# Altium schematic sheet Sheet1.SchDoc
size 381 x 241 mm
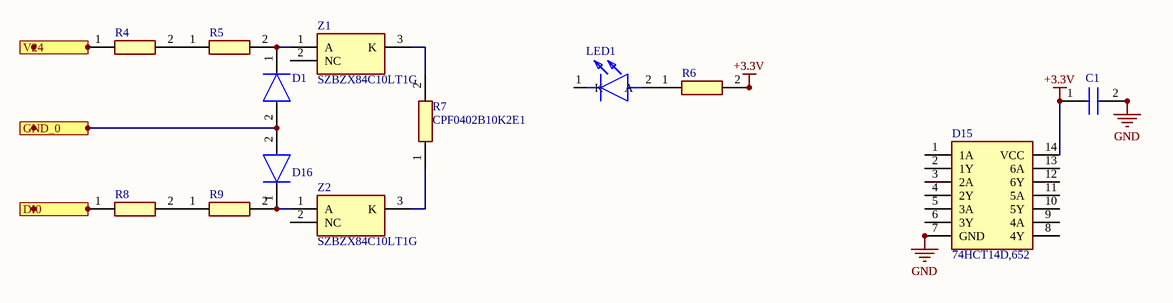
[diagram p0: Sheet1.SchDoc]

## Parts
C1  04023C104JAT2A  [CAPC1005X56N]  (value not drawn)
D1  SMF18AT1G  [SODFL3616X98N]  (value not drawn)
D15  74HCT14D,652  [SOIC127P600X175-14N]
D16  SMF18AT1G  [SODFL3616X98N]  (value not drawn)
LED1  151034GS03000  [151034GS03000]  (value not drawn)
R4  CPF0805B330RE  [RESC2012X65N]  (value not drawn)
R5  CPF0805B330RE  [RESC2012X65N]  (value not drawn)
R6  CPF0402B300RE  [RESC1005X35N]  (value not drawn)
R7  CPF0402B10K2E1  [RESC1005X35N]
R8  CPF0805B330RE  [RESC2012X65N]  (value not drawn)
R9  CPF0805B330RE  [RESC2012X65N]  (value not drawn)
Z1  SZBZX84C10LT1G  [SOT96P237X111-3N]
Z2  SZBZX84C10LT1G  [SOT96P237X111-3N]

## Ports
DI0, GND0, GND_0, V24

## Nets
+3.3V: C1.1 D15.14(VCC) R6.2
GND: C1.2 D15.7(GND)
DI0: R8.1 ; port DI0
GND0: D1.2(A) D16.2(A) ; port GND0, port GND_0
V24: R4.1 ; port V24
NetD1_1: D1.1(K) R5.2 Z1.1(A)
NetD16_1: D16.1(K) R9.2 Z2.1(A)
NetLED1_2: LED1.2(A) R6.1
NetR4_2: R4.2 R5.1
NetR7_1: R7.1 Z2.3(K)
NetR7_2: R7.2 Z1.3(K)
NetR8_2: R8.2 R9.1

Not connected (* = marked no-connect by the designer): D15 1(1A) 2(1Y) 3(2A) 4(2Y) 5(3A) 6(3Y) 8(4Y) 9(4A) 10(5Y) 11(5A) 12(6Y) 13(6A); LED1 1(K); Z1 2(NC); Z2 2(NC)

## Library data of the parts
C1 = 04023C104JAT2A: Capacitor; Manufacturer_Name: AVX; Datasheet Link: http://www.mouser.com/catalog/supplier/library/pdf/AVXSurfaceMountCeramic.pdf; Height: 0.56mm; Manufacturer_Part_Number: 04023C104JAT2A; Mouser Part Number: 581-04023C104JAT2A; Mouser Price/Stock: http://www.mouser.com/Search/ProductDetail.aspx?qs=ZBeOGGPQgEHeKFST9wrKRw%3d%3d; RS Part Number: 1356696; RS Price/Stock: https://uk.rs-online.com/web/p/products/1356696
D1 D16 = SMF18AT1G: Diode; Manufacturer_Name: ON Semiconductor; Allied_Number: 70600054; Datasheet Link: http://www.onsemi.com/pub/Collateral/SMF5.0AT1-D.PDF; Height: 0.98mm; Manufacturer_Part_Number: SMF18AT1G; Allied Price/Stock: http://www.alliedelec.com/on-semiconductor-smf18at1g/70600054/
D15 = 74HCT14D,652: Integrated Circuit; Manufacturer_Name: Nexperia; Datasheet Link: https://assets.nexperia.com/documents/data-sheet/74HC_HCT14.pdf; Height: 1.75mm; Manufacturer_Part_Number: 74HCT14D,652; Mouser Part Number: 771-HCT14D652; Mouser Price/Stock: https://www.mouser.com/Search/Refine.aspx?Keyword=771-HCT14D652; RS Part Number: 1130641P; RS Price/Stock: http://uk.rs-online.com/web/p/products/1130641P
LED1 = 151034GS03000: LED; Manufacturer_Name: Wurth Elektronik; Datasheet Link: http://katalog.we-online.de/led/datasheet/151034GS03000.pdf; Manufacturer_Part_Number: 151034GS03000; RS Part Number: 9010930; RS Price/Stock: https://uk.rs-online.com/web/p/products/9010930
R4 R5 R8 R9 = CPF0805B330RE: Resistor; Manufacturer_Name: TE Connectivity; Allied_Number: 70286839; Datasheet Link: http://docs-europe.electrocomponents.com/webdocs/13d1/0900766b813d116f.pdf; Height: 0.65mm; Manufacturer_Part_Number: CPF0805B330RE; RS Part Number: 6662471; RS Price/Stock: https://uk.rs-online.com/web/p/products/6662471; Allied Price/Stock: https://www.alliedelec.com/te-connectivity-cpf0805b330re/70286839/
R6 = CPF0402B300RE: Resistor; Manufacturer_Name: TE Connectivity; Datasheet Link: http://www.farnell.com/datasheets/1786775.pdf; Height: 0.35mm; Manufacturer_Part_Number: CPF0402B300RE; RS Part Number: 6661327; RS Price/Stock: https://uk.rs-online.com/web/p/products/6661327
R7 = CPF0402B10K2E1: Resistor; Manufacturer_Name: TE Connectivity; Allied_Number: 70286155; Datasheet Link: http://www.farnell.com/datasheets/1786775.pdf; Height: 0.35mm; Manufacturer_Part_Number: CPF0402B10K2E1; Mouser Part Number: 279-CPF0402B10K2E1; Mouser Price/Stock: https://www.mouser.com/Search/Refine.aspx?Keyword=279-CPF0402B10K2E1; RS Part Number: 7015028; RS Price/Stock: https://uk.rs-online.com/web/p/products/7015028; Allied Price/Stock: https://www.alliedelec.com/te-connectivity-cpf0402b10k2e1/70286155/
Z1 Z2 = SZBZX84C10LT1G: Zener Diode; Manufacturer_Name: ON Semiconductor; Allied_Number: 70467681; Datasheet Link: http://www.onsemi.com/pub/Collateral/BZX84C2V4LT1-D.PDF; Height: 1.11mm; Manufacturer_Part_Number: SZBZX84C10LT1G; Mouser Part Number: 863-SZBZX84C10LT1G; Mouser Price/Stock: https://www.mouser.com/Search/Refine.aspx?Keyword=863-SZBZX84C10LT1G; RS Part Number: 8052914; RS Price/Stock: http://uk.rs-online.com/web/p/products/8052914; Allied Price/Stock: http://www.alliedelec.com/on-semiconductor-szbzx84c10lt1g/70467681/